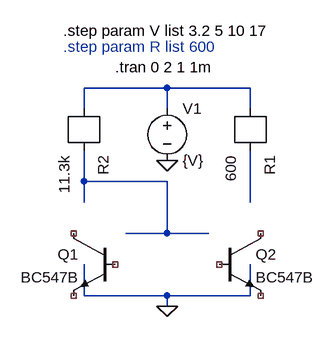
[diagram p0: schematic marlon_1-1.asc]
marlon_1-1.asc, the LTspice schematic file:
Version 4
SHEET 1 880 680
WIRE 368 96 240 96
WIRE 496 96 368 96
WIRE 240 128 240 96
WIRE 368 128 368 96
WIRE 496 128 496 96
WIRE 240 240 240 192
WIRE 368 240 240 240
WIRE 240 272 240 240
WIRE 496 272 496 192
WIRE 368 320 368 240
WIRE 368 320 304 320
WIRE 432 320 368 320
WIRE 240 416 240 368
WIRE 368 416 240 416
WIRE 496 416 496 368
WIRE 496 416 368 416
WIRE 368 432 368 416
FLAG 368 432 0
FLAG 368 208 0
SYMBOL npn 288 320 M0
SYMATTR InstName Q1
SYMATTR Value BC547B
SYMBOL npn 448 320 R0
SYMATTR InstName Q2
SYMATTR Value BC547B
SYMBOL r 240 128 R90
SYMATTR InstName R2
SYMATTR Value 11.3k
SYMBOL r 496 128 R90
SYMATTR InstName R1
SYMATTR Value 600
SYMBOL voltage 368 112 R0
SYMATTR InstName V1
SYMATTR Value {V}
TEXT 288 64 Left 2 !.tran 0 2 1 1m
TEXT 208 32 Left 2 ;.step param R list 600
TEXT 208 8 Left 2 !.step param V list 3.2 5 10 17

The netlist it stands for:
* marlon_1-1.asc
* Q1: BC547B (symbol npn not certain, pin order unknown); nets seen at it: 0
* Q2: BC547B (symbol npn not certain, pin order unknown); nets seen at it: 0
R2 N002 N001 11.3k
R1 N003 N001 600
V1 N001 0 {V}
.tran 0 2 1 1m
* .step param R list 600
.step param V list 3.2 5 10 17
.backanno
.end